# EasyEDA schematic SCH_IR-rotary-encoder-bruker-trinket_2024-10-31.json
TITLE: IR rotary encoder bruker; REV: 1.2; Date: 2022-04-08; Sheet: 1/1; Drawn By: Stephen Zhang; Company: Stephen X. Zhang
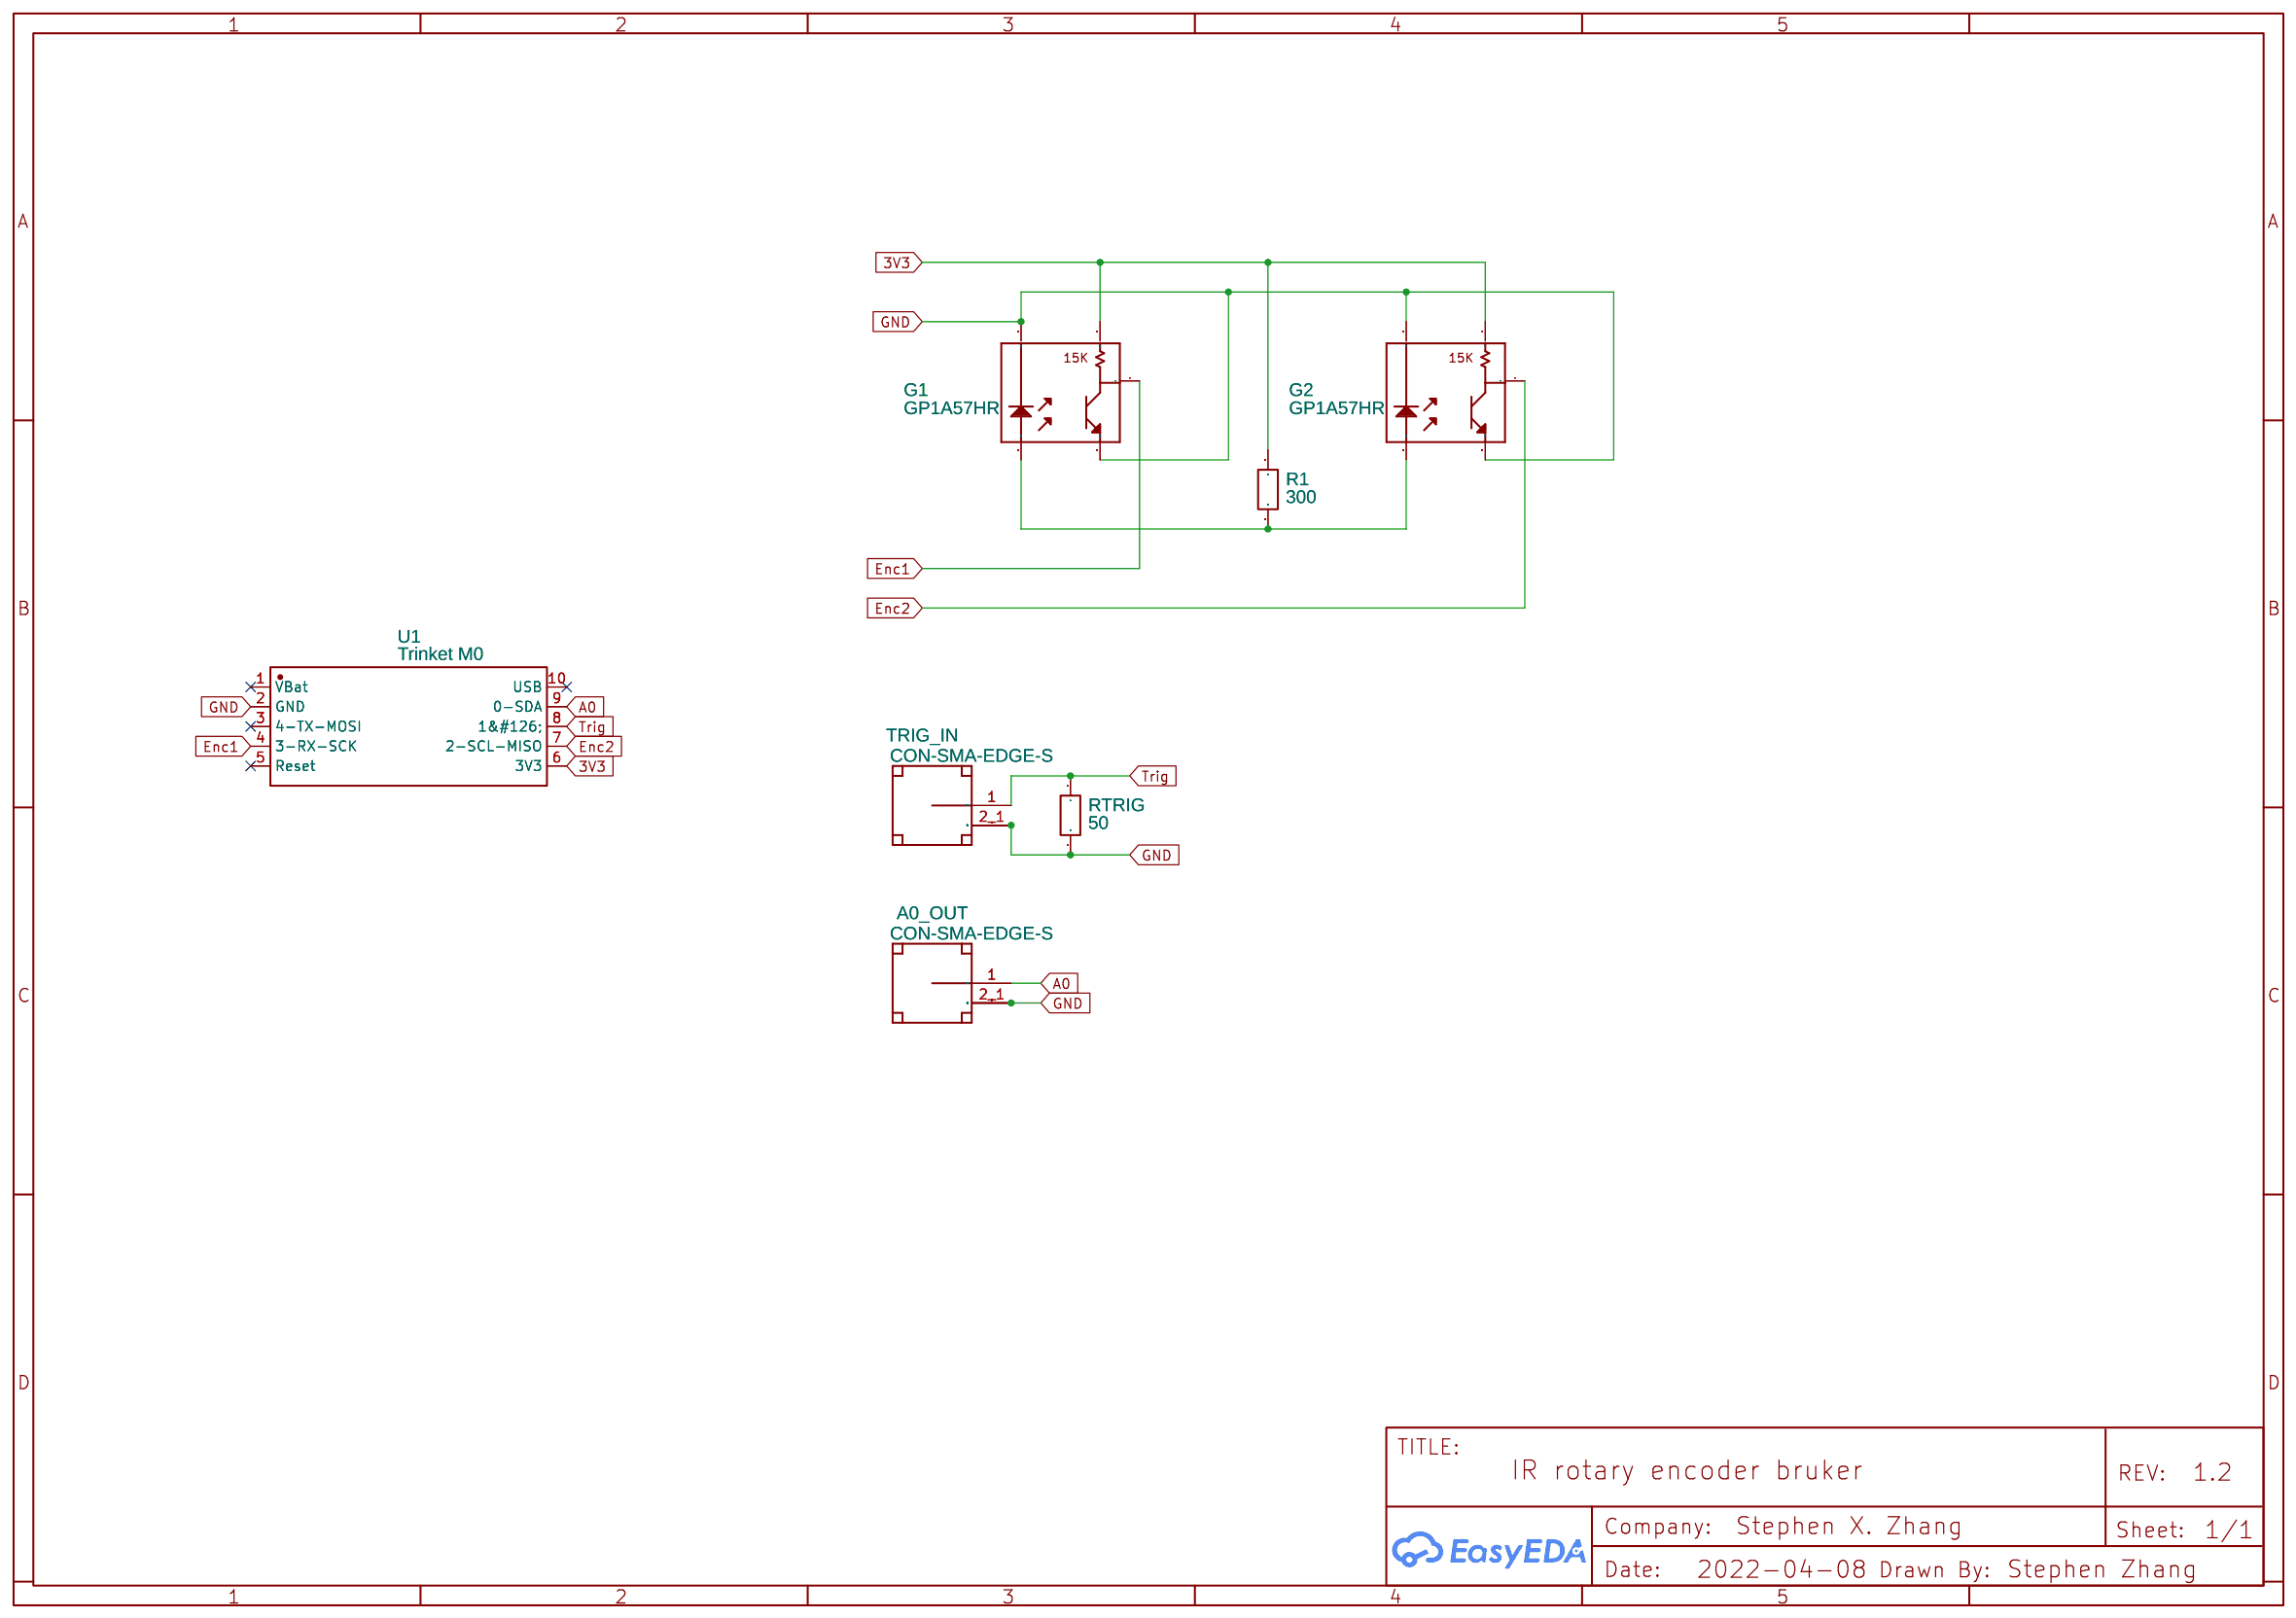
[diagram p0: schematic sheet]

## Parts
A0_OUT  CON-SMA-EDGE-S  [CON-SMA-EDGE-S]
G1  GP1A57HR  [GP1A57HR]
G2  GP1A57HR  [GP1A57HR]
R1  300  [RES-TH_BD2.4-L6.3-P10.30-D0.6]
RTRIG  50  [RES-TH_BD2.4-L6.3-P10.30-D0.6]
TRIG_IN  CON-SMA-EDGE-S  [CON-SMA-EDGE-S]
U1  Trinket M0  [TRINKET_MO]

## Library data of the parts
A0_OUT TRIG_IN = CON-SMA-EDGE-S: Contributor: mustadem
G1 G2 = GP1A57HR: Contributor: Leonardo Bellettini
R1 RTRIG = RD 1/4W 200R J T/B A1: Supplier: LCSC; Supplier Part: C433755; Manufacturer: TyoHM; Contributor: LCSC; JLCPCB Part Class: Extended Part; Resistance: 200Ω
U1 = Trinket M0: Manufacturer: Adafruit; Manufacturer Part: 3500; link: https://www.adafruit.com/product/3500?gclid=Cj0KCQiAs5eCBhCBARIsAEhk4r5RN0i8pJS8kJEaamc-NUVHByQMQzBjkX1k71KAMlb44MGya5rKpVgaAsi5EALw_wcB; Contributor: JuergL

## Nets
3V3: G1.3 G2.3 R1.1 U1.6(3V3)
GND: A0_OUT.2_1(GND) A0_OUT.2_2(GND) A0_OUT.3_1(GND) A0_OUT.3_2(GND) G1.2 G1.5 G2.2 G2.5 RTRIG.2 TRIG_IN.2_1(GND) TRIG_IN.2_2(GND) TRIG_IN.3_1(GND) TRIG_IN.3_2(GND) U1.2(GND)
A0: A0_OUT.1(SIGNAL) U1.9(0-SDA)
Enc1: G1.4 U1.4(3-RX-SCK)
Enc2: G2.4 U1.7(2-SCL-MISO)
Trig: RTRIG.1 TRIG_IN.1(SIGNAL) U1.8(1&#126;)
Net-(G1-1): G1.1 G2.1 R1.2

Not connected (* = marked no-connect by the designer): U1 1(VBat)* 3(4-TX-MOSI)* 5(Reset)* 10(USB)*
